# EAGLE design main board (EAGLE 9.5.0)
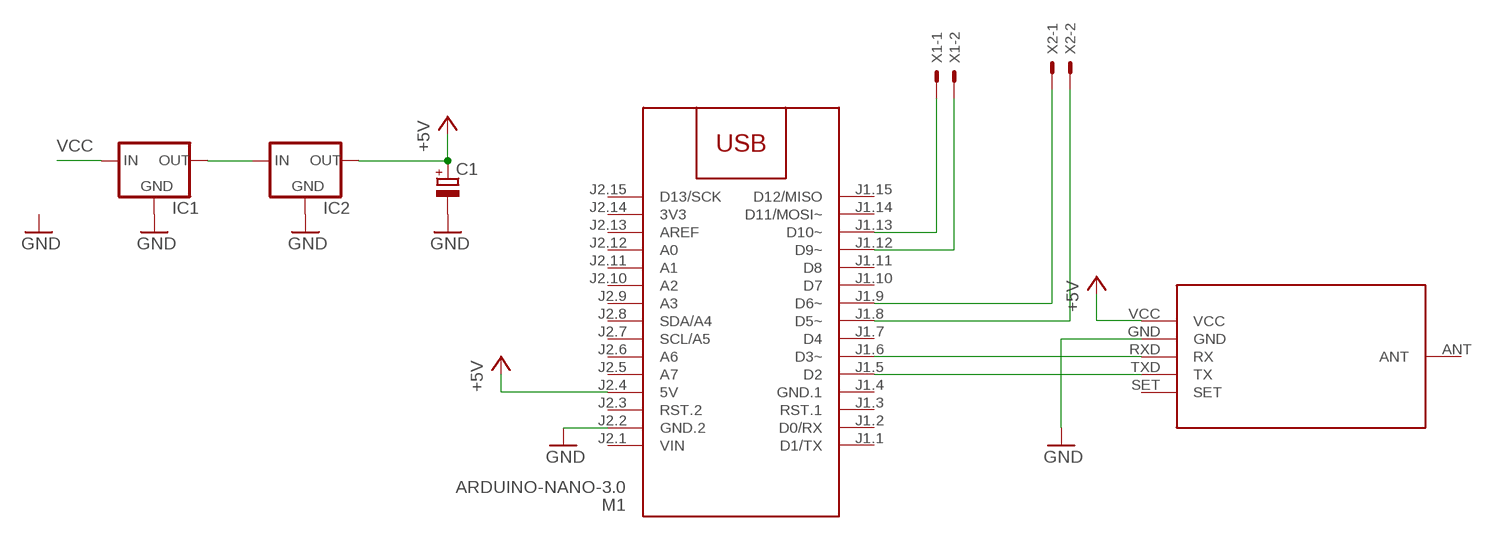
[diagram p0: schematic, sheet 1]

## Parts
C1  CPOL-EUE2.5-7  [E2,5-7]
IC1  78XXS  [78XXS]
IC2  78XXS  [78XXS]
M1  ARDUINO-NANO-3.0  [ARDUINO-NANO-3.0]
U$1  HC-12_FOOTPRINT  [HC-12_FOOTPRINT]
X1  22-23-2021  [22-23-2021]
X2  22-23-2021  [22-23-2021]

## Nets
+5V: C1.+ IC2.OUT M1.J2.4(5V) U$1.VCC
GND: C1.- IC1.GND IC2.GND M1.J2.2(GND.2) U$1.GND
N$1: M1.J1.5(D2) U$1.TXD(TX)
N$2: M1.J1.6(D3~) U$1.RXD(RX)
N$3: M1.J1.13(D10~) X1.1
N$4: M1.J1.12(D9~) X1.2
N$5: M1.J1.9(D6~) X2.1
N$6: M1.J1.8(D5~) X2.2
N$8: IC1.OUT IC2.IN
VCC: IC1.IN
Unconnected: M1.J1.1(D1/TX) M1.J1.2(D0/RX) M1.J1.3(RST.1) M1.J1.7(D4) M1.J1.10(D7) M1.J1.11(D8) M1.J1.14(D11/MOSI~) M1.J1.15(D12/MISO) M1.J2.3(RST.2) M1.J2.5(A7) M1.J2.6(A6) M1.J2.7(SCL/A5) M1.J2.8(SDA/A4) M1.J2.9(A3) M1.J2.10(A2) M1.J2.11(A1) M1.J2.12(A0) M1.J2.13(AREF) M1.J2.15(D13/SCK) U$1.ANT U$1.SET

## Power pins joined to a net without a drawn wire
3V3: M1.J2.14(3V3)
GND.1: M1.J1.4(GND.1)
VIN: M1.J2.1(VIN)

## Library data of the parts
C1 = rcl:CPOL-EU: POLARIZED CAPACITOR, European symbol; SPICEPREFIX: C
IC1 IC2 = v-reg:78XXS: VOLTAGE REGULATOR
M1 = diy-modules:ARDUINO-NANO-3.0: Arduino Nano 3.0 and compatible devices More details available here: https://www.arduino.cc/en/Main/ArduinoBoardNano Click here to find device on ebay.com <http://www.ebay.com/sch/arduino+nano>
U$1 = hc12_433mhz:HC-12_FOOTPRINT: HC-12 433MHz module footprint MCHFIX is for mechanical fix pin which is NC but on this file connected to GND https://github.com/meendiz/hc-12_si4463/
X1 X2 = con-molex:22-23-2021: .100" (2.54mm) Center Header - 2 Pin; MF: MOLEX; MPN: 22-23-2021; OC_FARNELL: 1462926; OC_NEWARK: 25C3832

## Board
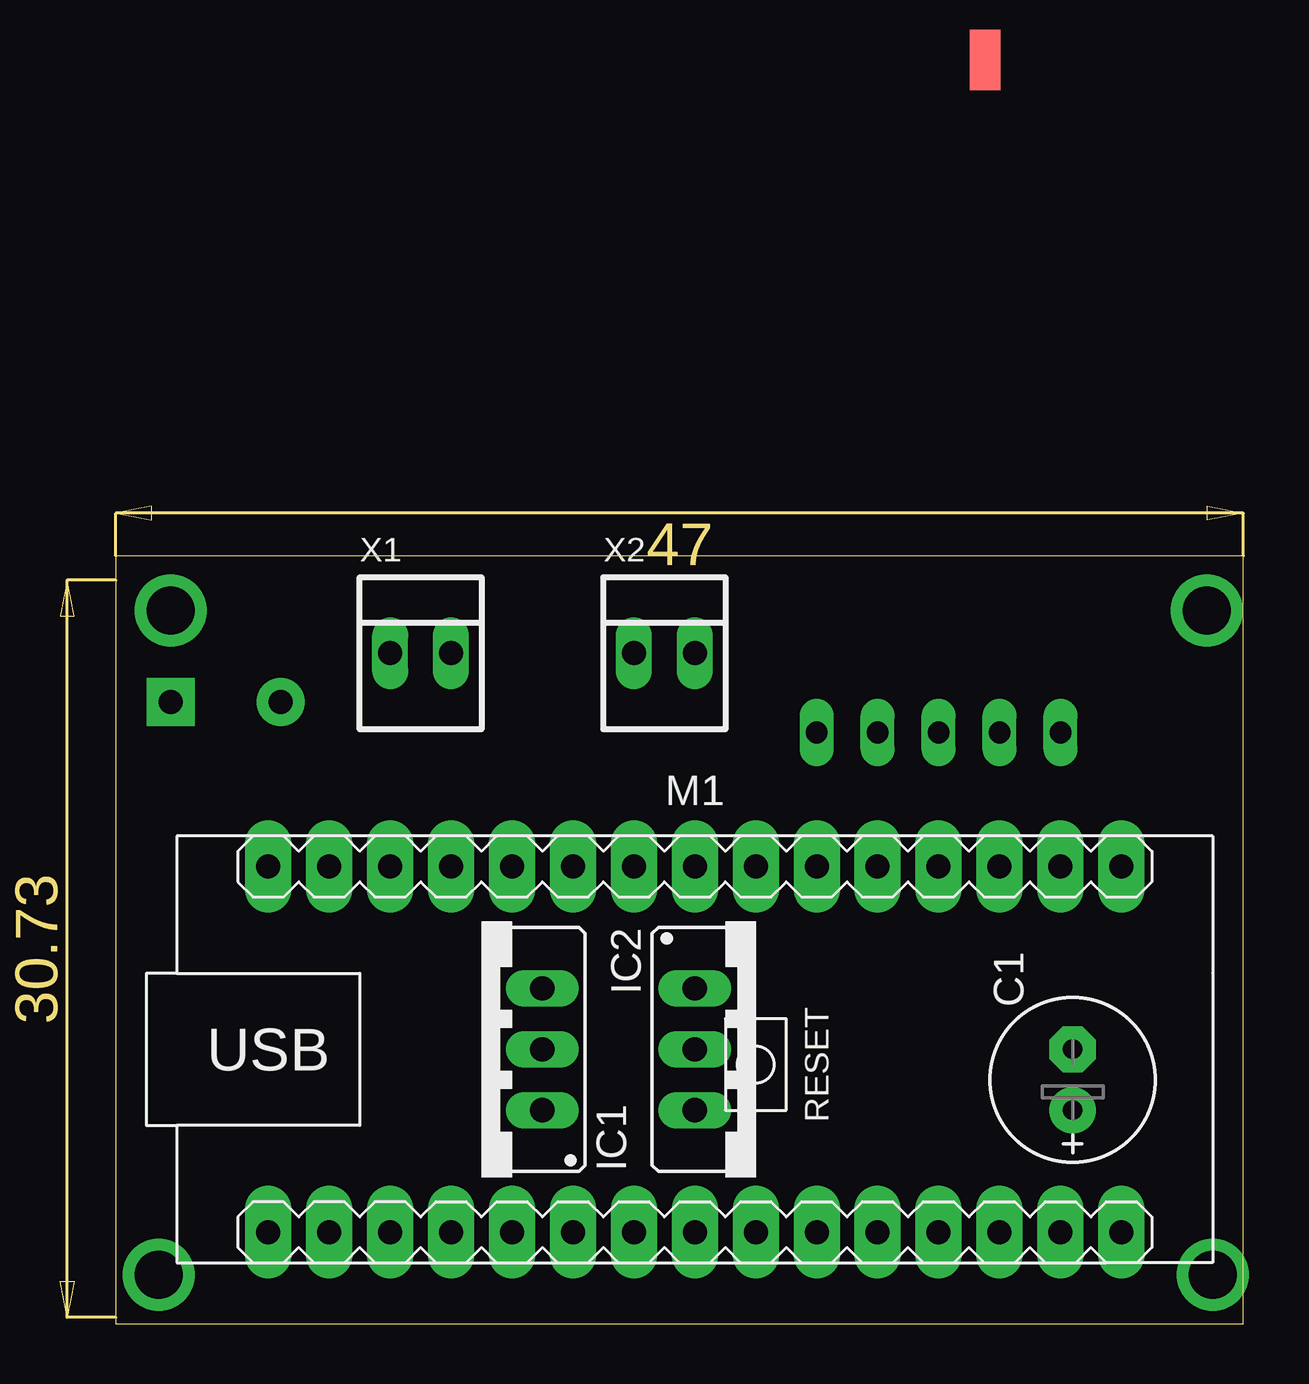
[diagram p1: board, top side]
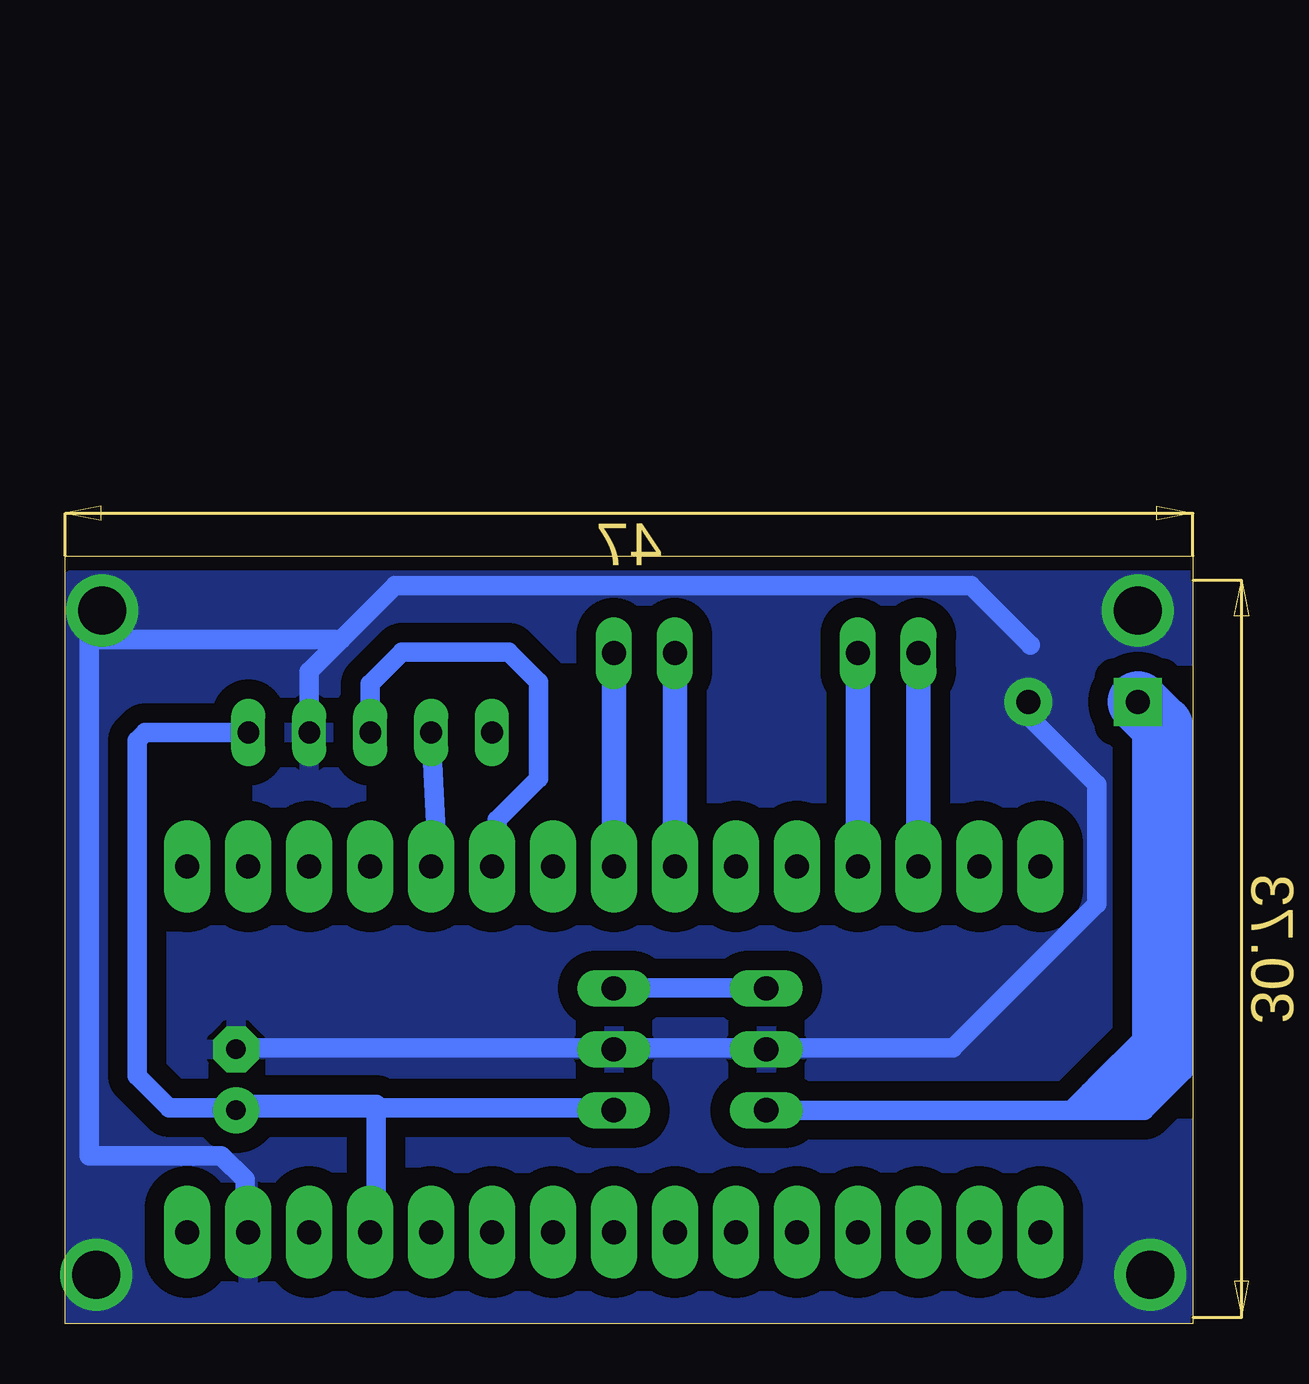
[diagram p2: board, bottom side, seen from below]

Size 47 x 32 mm. Coordinates in mm from the lower left corner, seen from the top.
Outline: 0,0 47,0 47,32 0,32 0,0
Copper layers (1*16): Top 0.035mm / dielectric 1.5mm / Bottom 0.035mm
Design rules "default *": minimum track width 32mil, minimum drill 0.35mm, track to track 32mil, track to pad 24mil, pad to pad 24mil, via to via 24mil, smd to smd 24mil, copper to edge 1mil, drill to drill 6mil, minimum pad ring 10mil, minimum via ring 8mil, stop-mask expansion 4mil, vias tented up to drill 0mil, thermal gap 10mil

### Footprints (pad centres in the part's own frame; a part is rotated, then mirrored left to right if it is on the bottom)
E2,5-7 = drill 0.813 pad 1.93: + -1.27,0 | drill 0.813 pad 1.93 octagon: - 1.27,0
78XXS = drill 1.016 long: GND 0,-2.54; IN -2.54,-2.54; OUT 2.54,-2.54
ARDUINO-NANO-3.0 = drill 1 pad 1.93 long: J1.1 17.78,7.62; J1.2 15.24,7.62; J1.3 12.7,7.62; J1.4 10.16,7.62; J1.5 7.62,7.62; J1.6 5.08,7.62; J1.7 2.54,7.62; J1.8 0,7.62; J1.9 -2.54,7.62; J1.10 -5.08,7.62; J1.11 -7.62,7.62; J1.12 -10.16,7.62; J1.13 -12.7,7.62; J1.14 -15.24,7.62; J1.15 -17.78,7.62; J2.1 17.78,-7.62; J2.2 15.24,-7.62; J2.3 12.7,-7.62; J2.4 10.16,-7.62; J2.5 7.62,-7.62; J2.6 5.08,-7.62; J2.7 2.54,-7.62; J2.8 0,-7.62; J2.9 -2.54,-7.62; J2.10 -5.08,-7.62; J2.11 -7.62,-7.62; J2.12 -10.16,-7.62; J2.13 -12.7,-7.62; J2.14 -15.24,-7.62; J2.15 -17.78,-7.62
HC-12_FOOTPRINT = smd 2.54 x 1.27: ANT 29.3,4.4 | drill 0.9 pad 1.27 long: GND 1.27,3.81; RXD 1.27,6.35; SET 1.27,11.43; TXD 1.27,8.89; VCC 1.27,1.27
22-23-2021 = drill 1 long: 1 -1.27,0; 2 1.27,0

### Placement (x,y rotation side)
C1  39.88,10.16 90 top
IC1  15.24,11.43 90 top
IC2  26.67,11.43 270 top
M1  24.13,11.43 0 top
U$1  40.64,23.37 90 top
X1  12.7,27.94 0 top
X2  22.86,27.94 0 top

### Tracks (layer width: path | path; a pad name or v marks a point on that pad's centre or on a via)
+5V
  Bottom 0.813: U$1.VCC 43.66,24.64 44,24.3 44,10.33 42.67,9 40.09,9 C1.+ | IC2.OUT 24.5,9 39.59,9 C1.+ | C1.+ 39.62,9.14 34.04,9.14 34.04,4.06 M1.J2.4
GND  (via drill 1 pad 2, 2 pad 2.4)
  Bottom 0.813: C1.- 39.59,11.5 24.5,11.5 IC2.GND 24,11.5 18,11.5 IC1.GND 17.53,11.49 10.01,11.49 4,17.5 4,22.46 6.86,25.32 v6.86,25.91 | U$1.GND 36.83,27.17 35.49,28.51 | 35.49,28.51 46,28.51 46,7 40.49,7 39.5,6.01 39.5,4 M1.J2.2 | 35.49,28.51 33.25,30.75 9.24,30.75 6.77,28.28
  other vias: 1.78,2.03 45.47,29.72 2.29,29.72 45.72,2.03
  pour Bottom: 0,30.99 46.74,30.99 46.74,0.25 0,0.25
N$1
  Bottom 0.813: U$1.TXD 31.5,19.64 31.5,19.5 M1.J1.5
N$2
  Bottom 0.813: U$1.RXD 34.29,26.67 32.96,28 28.52,28 27.27,26.75 27.27,22.73 29,21 29,19.5 M1.J1.6
N$3
  Bottom 0.813: 11.5,19.5 M1.J1.13
  Bottom 1.016: X1.1 11.43,19.57 11.5,19.5
N$4
  Bottom 1.016: X1.2 M1.J1.12
N$5
  Bottom 0.813: 21.57,19.15 M1.J1.9
  Bottom 1.016: X2.1 21.59,19.17 21.57,19.15
N$6
  Bottom 1.016: X2.2 M1.J1.8
N$8
  Bottom 0.813: IC1.OUT 18,14 24,14 IC2.IN
VCC  (via drill 1 pad 2)
  Bottom 0.813: 4.32,8.89 5.08,8.89 | 5.08,8.89 IC1.IN | 1.27,11.94 4.32,8.89 | 4.32,8.89 2.03,8.89 0.38,10.54 0.38,11.94 2.03,11.94 4.06,9.91 | 4.06,9.91 4.32,9.65 | 4.32,9.65 4.32,9.14 2.54,9.14 1.02,10.67 1.78,10.67 2.79,9.65 | 3.81,9.91 4.06,9.91 | 4.32,9.65 5.08,8.89 | 1.27,24.64 0.51,24.64
  Bottom 2.54: v2.29,25.91 1.27,24.89 1.27,24.64 1.27,11.94